# Altium project DMX Interface DB v2.PrjPcb (part 1 of 5)
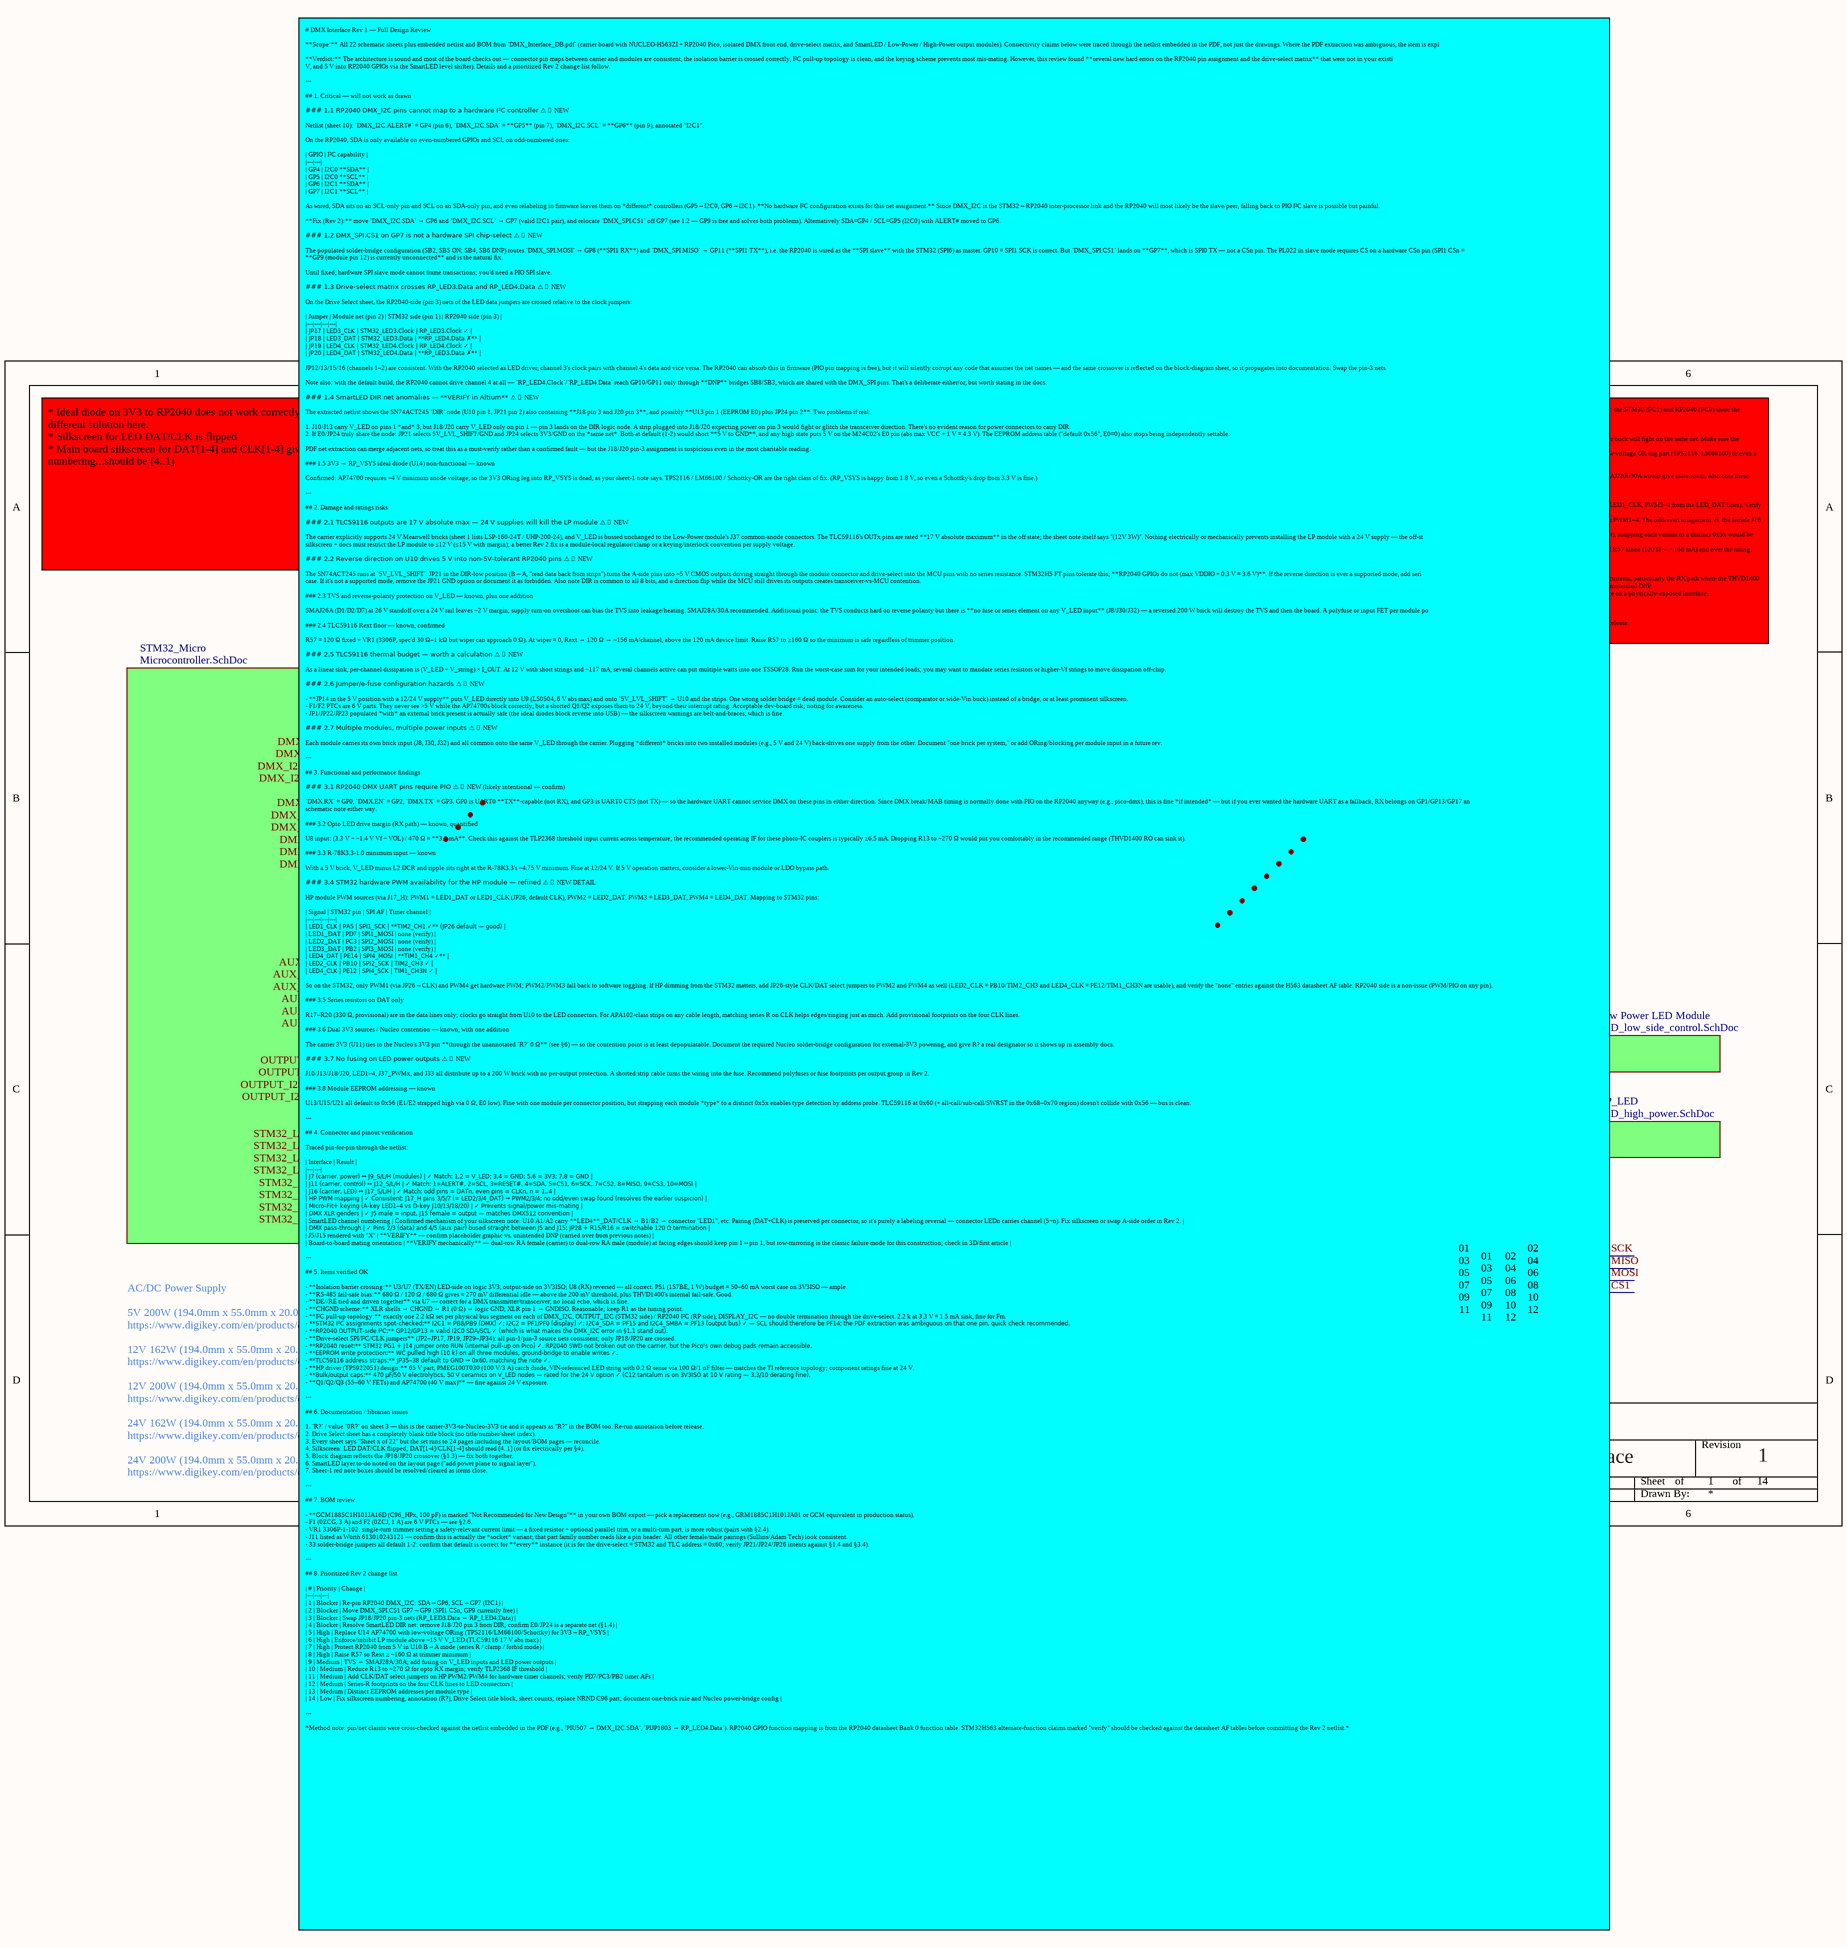
[diagram p0: Block Diagram.SchDoc]
PROJECT_TITLE: DMX Interface; REV: 1
14 sheets, 320 parts. Net scope: hierarchical (ports join the sheet entries above them; power ports are global).
Board file: DMX Interface.PcbDoc
Sheets:
  Block Diagram.SchDoc
    DMX_RP2040 = DMX_RP2040.SchDoc
      DMX = DMX.SchDoc
      PI = RP2040.SchDoc
    Low Power LED Module = LED_low_side_control.SchDoc
      PWM1 = LED_low_side_connector.SchDoc
      PWM2 = LED_low_side_connector.SchDoc
      PWM3 = LED_low_side_connector.SchDoc
      L = Module Connector Male.SchDoc
      PWM4 = LED_low_side_connector.SchDoc
    STM32_Micro = Microcontroller.SchDoc
      MI = STM32.SchDoc
    SL = SmartLED.SchDoc
      S = Module Connector Male.SchDoc
    HP_LED = LED_high_power.SchDoc
      H = Module Connector Male.SchDoc
      HP1 = TPS922051.SchDoc
      HP2 = TPS922051.SchDoc
      HP3 = TPS922051.SchDoc
      HP4 = TPS922051.SchDoc
    MC = Module Connector Female.SchDoc
    DS = Drive Select.SchDoc

## Sheet Block Diagram.SchDoc: Block Diagram
size B; SheetNumber: 1; SheetTotal: 14

### Parts
J22  Header 6x2 0.1"  [HEADER 6x2 0.1 Through hole]  (value not drawn)

### Sub-sheets
DMX_RP2040 = DMX_RP2040.SchDoc: RESET# (in), RP2040_SCL, RP2040_SDA, RP2040_I2C_RESET, RP2040_I2C_ALERT, RP_LED1.Clock, RP_LED2.Clock, RP_LED3.Clock, RP_LED4.Clock, RP_LED1.Data, RP_LED2.Data, RP_LED3.Data, RP_LED4.Data, DMX_I2C.SCL, DMX_I2C.SDA, DMX_I2C.ALERT#, DMX_I2C.RESET#, DMX_SPI.SCK, DMX_SPI.MISO, DMX_SPI.MOSI, DMX_SPI.CS1
DS = Drive Select.SchDoc: SCK, MISO, MOSI, CS1, CS2, CS3, SCL, SDA, I2C_ALERT#, I2C_RESET#, LED1_CLK (bidir), LED2_CLK (bidir), LED3_CLK (bidir), LED4_CLK (bidir), LED1_DAT (bidir), LED2_DAT (bidir), LED3_DAT (bidir), LED4_DAT (bidir), AUX_SPI.SCK, DMX_SPI.SCK, AUX_SPI.MISO, DMX_SPI.MISO, AUX_SPI.MOSI, DMX_SPI.MOSI, AUX_SPI.CS1, DMX_SPI.CS1, AUX_SPI.CS2, AUX_SPI.CS3, OUTPUT_I2C.SCL, RP2040_SCL, OUTPUT_I2C.SDA, RP2040_SDA, RP2040_I2C_RESET, STM32_LED1.Clock, RP_LED1.Clock, STM32_LED2.Clock, RP_LED2.Clock, STM32_LED3.Clock, RP_LED3.Clock, STM32_LED4.Clock, RP_LED4.Clock, STM32_LED1.Data, RP_LED1.Data, RP_LED2.Data, RP_LED4.Data, STM32_LED2.Data, STM32_LED3.Data, STM32_LED4.Data, RP_LED3.Data, OUTPUT_I2C.ALERT#, OUTPUT_I2C.RESET#, RP2040_I2C_ALERT, DMX_SPI.CS3, DMX_SPI.CS2
HP_LED = LED_high_power.SchDoc: no entries
Low Power LED Module = LED_low_side_control.SchDoc: no entries
MC = Module Connector Female.SchDoc: SCK, MISO, MOSI, CS1, CS2, CS3, SCL, SDA, I2C_ALERT#, I2C_RESET#, LED1_CLK (in), LED2_CLK (in), LED3_CLK (in), LED4_CLK (in), LED1_DAT (in), LED2_DAT (in), LED3_DAT (in), LED4_DAT (in)
SL = SmartLED.SchDoc: LED1_CLK (bidir), LED2_CLK (bidir), LED3_CLK (bidir), LED4_CLK (bidir), LED1_DAT (bidir), LED2_DAT (bidir), LED3_DAT (bidir), LED4_DAT (bidir)
STM32_Micro = Microcontroller.SchDoc: RESET# (out), DMX_I2C.SCL, DMX_I2C.SDA, DMX_I2C.ALERT#, DMX_I2C.RESET#, DMX_SPI.SCK, DMX_SPI.MISO, DMX_SPI.MOSI, DMX_SPI.CS1, DMX_SPI.CS2, DMX_SPI.CS3, AUX_SPI.SCK, AUX_SPI.MISO, AUX_SPI.MOSI, AUX_SPI.CS1, AUX_SPI.CS2, AUX_SPI.CS3, OUTPUT_I2C.SCL, OUTPUT_I2C.SDA, OUTPUT_I2C.ALERT#, OUTPUT_I2C.RESET#, STM32_LED1.Clock, STM32_LED2.Clock, STM32_LED3.Clock, STM32_LED4.Clock, STM32_LED1.Data, STM32_LED2.Data, STM32_LED3.Data, STM32_LED4.Data

### Nets
3V3: J22.09
GND: J22.11
AUX_SPI.CS1: sheet STM32_Micro/AUX_SPI.CS1, sheet DS/AUX_SPI.CS1
AUX_SPI.CS2: sheet STM32_Micro/AUX_SPI.CS2, sheet DS/AUX_SPI.CS2
AUX_SPI.CS3: sheet STM32_Micro/AUX_SPI.CS3, sheet DS/AUX_SPI.CS3
AUX_SPI.MISO: sheet STM32_Micro/AUX_SPI.MISO, sheet DS/AUX_SPI.MISO
AUX_SPI.MOSI: sheet STM32_Micro/AUX_SPI.MOSI, sheet DS/AUX_SPI.MOSI
AUX_SPI.SCK: sheet STM32_Micro/AUX_SPI.SCK, sheet DS/AUX_SPI.SCK
CS1: sheet MC/CS1, sheet DS/CS1
CS2: sheet MC/CS2, sheet DS/CS2
CS3: sheet MC/CS3, sheet DS/CS3
DMX_I2C.ALERT#: J22.05 ; sheet DMX_RP2040/DMX_I2C.ALERT#, sheet STM32_Micro/DMX_I2C.ALERT#
DMX_I2C.RESET#: J22.07 ; sheet DMX_RP2040/DMX_I2C.RESET#, sheet STM32_Micro/DMX_I2C.RESET#
DMX_I2C.SCL: J22.01 ; sheet DMX_RP2040/DMX_I2C.SCL, sheet STM32_Micro/DMX_I2C.SCL
DMX_I2C.SDA: J22.03 ; sheet DMX_RP2040/DMX_I2C.SDA, sheet STM32_Micro/DMX_I2C.SDA
DMX_SPI.CS1: J22.08 ; sheet DMX_RP2040/DMX_SPI.CS1, sheet STM32_Micro/DMX_SPI.CS1, sheet DS/DMX_SPI.CS1
DMX_SPI.CS2: sheet STM32_Micro/DMX_SPI.CS2, sheet DS/DMX_SPI.CS2
DMX_SPI.CS3: sheet STM32_Micro/DMX_SPI.CS3, sheet DS/DMX_SPI.CS3
DMX_SPI.MISO: J22.04 ; sheet DMX_RP2040/DMX_SPI.MISO, sheet STM32_Micro/DMX_SPI.MISO, sheet DS/DMX_SPI.MISO
DMX_SPI.MOSI: J22.06 ; sheet DMX_RP2040/DMX_SPI.MOSI, sheet STM32_Micro/DMX_SPI.MOSI, sheet DS/DMX_SPI.MOSI
DMX_SPI.SCK: J22.02 ; sheet DMX_RP2040/DMX_SPI.SCK, sheet STM32_Micro/DMX_SPI.SCK, sheet DS/DMX_SPI.SCK
I2C_ALERT#: sheet MC/I2C_ALERT#, sheet DS/I2C_ALERT#
I2C_RESET#: sheet MC/I2C_RESET#, sheet DS/I2C_RESET#
LED1_CLK: sheet SL/LED1_CLK, sheet MC/LED1_CLK, sheet DS/LED1_CLK
LED1_DAT: sheet SL/LED1_DAT, sheet MC/LED1_DAT, sheet DS/LED1_DAT
LED2_CLK: sheet SL/LED2_CLK, sheet MC/LED2_CLK, sheet DS/LED2_CLK
LED2_DAT: sheet SL/LED2_DAT, sheet MC/LED2_DAT, sheet DS/LED2_DAT
LED3_CLK: sheet SL/LED3_CLK, sheet MC/LED3_CLK, sheet DS/LED3_CLK
LED3_DAT: sheet SL/LED3_DAT, sheet MC/LED3_DAT, sheet DS/LED3_DAT
LED4_CLK: sheet SL/LED4_CLK, sheet MC/LED4_CLK, sheet DS/LED4_CLK
LED4_DAT: sheet SL/LED4_DAT, sheet MC/LED4_DAT, sheet DS/LED4_DAT
MISO: sheet MC/MISO, sheet DS/MISO
MOSI: sheet MC/MOSI, sheet DS/MOSI
OUTPUT_I2C.ALERT#: sheet STM32_Micro/OUTPUT_I2C.ALERT#, sheet DS/OUTPUT_I2C.ALERT#
OUTPUT_I2C.RESET#: sheet STM32_Micro/OUTPUT_I2C.RESET#, sheet DS/OUTPUT_I2C.RESET#
OUTPUT_I2C.SCL: sheet STM32_Micro/OUTPUT_I2C.SCL, sheet DS/OUTPUT_I2C.SCL
OUTPUT_I2C.SDA: sheet STM32_Micro/OUTPUT_I2C.SDA, sheet DS/OUTPUT_I2C.SDA
RP2040_I2C_ALERT: sheet DMX_RP2040/RP2040_I2C_ALERT, sheet DS/RP2040_I2C_ALERT
RP2040_I2C_RESET: sheet DMX_RP2040/RP2040_I2C_RESET, sheet DS/RP2040_I2C_RESET
RP2040_RST#: sheet DMX_RP2040/RESET#, sheet STM32_Micro/RESET#
RP2040_SCL: sheet DMX_RP2040/RP2040_SCL, sheet DS/RP2040_SCL
RP2040_SDA: sheet DMX_RP2040/RP2040_SDA, sheet DS/RP2040_SDA
RP_LED1.Clock: sheet DMX_RP2040/RP_LED1.Clock, sheet DS/RP_LED1.Clock
RP_LED1.Data: sheet DMX_RP2040/RP_LED1.Data, sheet DS/RP_LED1.Data
RP_LED2.Clock: sheet DMX_RP2040/RP_LED2.Clock, sheet DS/RP_LED2.Clock
RP_LED2.Data: sheet DMX_RP2040/RP_LED2.Data, sheet DS/RP_LED2.Data
RP_LED3.Clock: sheet DMX_RP2040/RP_LED3.Clock, sheet DS/RP_LED3.Clock
RP_LED3.Data: sheet DMX_RP2040/RP_LED3.Data, sheet DS/RP_LED3.Data
RP_LED4.Clock: sheet DMX_RP2040/RP_LED4.Clock, sheet DS/RP_LED4.Clock
RP_LED4.Data: sheet DMX_RP2040/RP_LED4.Data, sheet DS/RP_LED4.Data
SCK: sheet MC/SCK, sheet DS/SCK
SCL: sheet MC/SCL, sheet DS/SCL
SDA: sheet MC/SDA, sheet DS/SDA
STM32_LED1.Clock: sheet STM32_Micro/STM32_LED1.Clock, sheet DS/STM32_LED1.Clock
STM32_LED1.Data: sheet STM32_Micro/STM32_LED1.Data, sheet DS/STM32_LED1.Data
STM32_LED2.Clock: sheet STM32_Micro/STM32_LED2.Clock, sheet DS/STM32_LED2.Clock
STM32_LED2.Data: sheet STM32_Micro/STM32_LED2.Data, sheet DS/STM32_LED2.Data
STM32_LED3.Clock: sheet STM32_Micro/STM32_LED3.Clock, sheet DS/STM32_LED3.Clock
STM32_LED3.Data: sheet STM32_Micro/STM32_LED3.Data, sheet DS/STM32_LED3.Data
STM32_LED4.Clock: sheet STM32_Micro/STM32_LED4.Clock, sheet DS/STM32_LED4.Clock
STM32_LED4.Data: sheet STM32_Micro/STM32_LED4.Data, sheet DS/STM32_LED4.Data

Not connected (* = marked no-connect by the designer): J22 10* 12*

### Notes on the sheet
- * Ideal diode on 3V3 to RP2040 does not work correctly when supply is less than 4V. Need a different solution here.
  * Silkscreen for LED DAT/CLK is flipped
  * Main board silkscreen for DAT[1-4] and CLK[1-4] give the wrong indication of the numbering...should be [4..1]
- This is a nicely architected board — the flexible "drive select" jumper matrix, the isolated DMX front end, per-module ID EEPROMs, and the interchangeable module-connector concept are all sensible. The core premise checks out: the STM32 (I²C1) and RP2040 (I²C0) share the `DMX_I2C` bus as the inter-processor link, and it's pulled up once (R26–R29, 2.2k to 3V3 on the STM32 side), so no double-termination. Below are the things worth a second look, roughly in priority order.
  **Power architecture (highest-value items)**
  - **Dual 3V3 sources / Nucleo contention.** The carrier generates 3V3 from U11 (R-78K3.3) and ties it to the Nucleo's CN8/CN11 3V3 pins. If the Nucleo is ever powered from its own ST-LINK USB, its onboard 3V3 LDO and your buck will fight on the same net. Make sure the Nucleo's power-source solder bridges are configured for external 3V3 (and document it), or isolate the two. Same logic applies to the 5V rail, though the jumper notes already address that path.
  - **AP74700 on the 3V3→RP_VSYS OR-ing (U14).** You've already flagged this on sheet 1 — the ideal-diode controller won't operate below ~4V, so the 3V3 leg is effectively dead. Since RP_VSYS is happy from ~1.8V up, a low-voltage OR-ing part (TPS2116, LM66100) or even a Schottky-OR would fix it cleanly.
  - **R-78K3.3 minimum input.** In the 5V-supply configuration V_LED ≈ 5V feeds U11. Confirm the R-78K3.3-1.0 min Vin (I believe ~4.75V) against 5V with ripple/droop — it's near the bottom of the window.
  - **TVS standoff margin.** D1/D2/D7 are SMAJ26A on a rail that can be 24V. 26V standoff over a 24V nominal is only ~2V of headroom, so turn-on overshoot from the Meanwell bricks could nibble the TVS leakage/heating. SMAJ28A/30A would give more room. Also note these clamp reverse polarity but don't truly protect it (no series element/fuse on V_LED), which is fine for a dev board but worth a conscious decision.
  **Functional / signal concerns**
  - **LED CLK/DAT pins doing double duty.** On SmartLED modules these lines are SPI (SPI1/2/3/4 SCK+MOSI on the STM32). On the HP module the same physical lines are repurposed as PWM dimming (PWM1 via JP26 from LED1_CLK, PWM2–4 from the LED_DAT lines). Verify that the specific STM32H563 pins mapped to those SPI functions *also* expose a timer channel for hardware PWM — otherwise HP dimming falls back to bit-banging. On the RP2040 side PIO makes this a non-issue.
  - **HP module PWM pin mapping.** Cross-check the `_H` male-connector definition (sheet 7: PWM2/3/4 on J17_H odd pins, LED nets on even) against how the HP module (sheet 17) actually consumes LED1_CLK/LED_DAT as PWM1–4. The odd/even assignment vs. the female J16 (pin1=LED1_DAT, pin2=LED1_CLK, …) is where I'd expect a swap to hide if there is one.
  - **Module EEPROM addresses.** U13 / U15 / U21 all default to 0x56. That's fine electrically since one module mounts per connector, but if you want host-side module-type detection by address probe (rather than reading content), strapping each variant to a distinct 0x5x would be handy. TLC59116 at 0x60 plus its default all-call/sub-call/SWReset addresses don't collide with 0x56, so that bus is clean.
  - **TLC59116 Rext / current limit.** Your own annotation lands at ~117 mA (Rext 150), just under the 120 mA/channel device max. But that assumes VR1's 30 Ω floor; a 3306P wiper can approach 0 Ω, which pushes Rext toward R57 alone (120 Ω → ~156 mA) and over the rating. Consider raising the fixed series resistor so the *minimum* Rext can't exceed the current limit regardless of trimmer position.
  **DMX / isolation**
  - The isolation looks well thought out — 1S7BE isolated DC-DC, TLP2368 optos on RX/EN/TX (fast enough for 250 kbps), fail-safe bias (R10/R11), switchable 120 Ω term via JP28. Two things to confirm: (1) the opto LED drive currents, particularly the RX path where the THVD1400 RO drives through R13 (470 Ω) — verify you're comfortably above the TLP2368 threshold with margin; and (2) both DMX connectors (J5/J15) render with an "X" over them — confirm that's just a placeholder graphic and not an unintended DNP.
  - For anything beyond bench use, consider a dedicated TVS across the DMX A/B lines. The THVD1400 has decent built-in IEC ESD/bus-fault ratings, so it may be sufficient for a dev board, but external protection is cheap insurance on a physically-exposed interface.
  **Completeness / documentation**
  - Sheet 3 has an unannotated part — `R?` with value `0R?` near the AUX/GPIO area. That needs a real designator and value (looks like annotation wasn't re-run, or it's a leftover placeholder).
  - The Drive Select sheet (22) has an entirely blank title block (no title, number, or sheet index). All sheets also show "Sheet 1 of 22" while the actual set runs to 24 pages including the board-stack report — worth reconciling before release.
  - Your existing silkscreen notes (LED DAT/CLK flipped; DAT[1-4]/CLK[1-4] should read [4..1]; SmartLED power-plane layer to-do) are all legitimate — no disagreement there.
- AC/DC Power Supply
  5V 200W (194.0mm x 55.0mm x 20.0mm)
  https://www.digikey.com/en/products/detail/mean-well-usa-inc/UHP-200A-5/7707187
  12V 162W (194.0mm x 55.0mm x 20.0mm)
  https://www.digikey.com/en/products/detail/mean-well-usa-inc/LSP-160-12T/11689253
  12V 200W (194.0mm x 55.0mm x 20.0mm)
  https://www.digikey.com/en/products/detail/mean-well-usa-inc/UHP-200-12/7707237
  24V 162W (194.0mm x 55.0mm x 20.0mm)
  https://www.digikey.com/en/products/detail/mean-well-usa-inc/LSP-160-24T/11689249
  24V 200W (194.0mm x 55.0mm x 20.0mm)
  https://www.digikey.com/en/products/detail/mean-well-usa-inc/UHP-200-24/7707239
- of
- (near J22) # DMX Interface Rev 1 — Full Design Review
  **Scope:** All 22 schematic sheets plus embedded netlist and BOM from `DMX_Interface_DB.pdf` (carrier board with NUCLEO-H563ZI + RP2040 Pico, isolated DMX front end, drive-select matrix, and SmartLED / Low-Power / High-Power output modules). Connectivity claims below were traced through the netlist embedded in the PDF, not just the drawings. Where the PDF extraction was ambiguous, the item is explicitly marked **VERIFY**.
  **Verdict:** The architecture is sound and most of the board checks out — connector pin maps between carrier and modules are consistent, the isolation barrier is crossed correctly, I²C pull-up topology is clean, and the keying scheme prevents most mis-mating. However, this review found **several new hard errors on the RP2040 pin assignment and the drive-select matrix** that were not in your existing notes, plus two **absolute-maximum-rating hazards** (TLC59116 at 24 V, and 5 V into RP2040 GPIOs via the SmartLED level shifter). Details and a prioritized Rev 2 change list follow.
  ---
  ## 1. Critical — will not work as drawn
  ### 1.1 RP2040 DMX_I2C pins cannot map to a hardware I²C controller ⚠️ NEW
  Netlist (sheet 10): `DMX_I2C.ALERT#` = GP4 (pin 6), `DMX_I2C.SDA` = **GP5** (pin 7), `DMX_I2C.SCL` = **GP6** (pin 9), annotated "I2C1".
  On the RP2040, SDA is only available on even-numbered GPIOs and SCL on odd-numbered ones:
  | GPIO | I²C capability |
  |---|---|
  | GP4 | I2C0 **SDA** |
  | GP5 | I2C0 **SCL** |
  | GP6 | I2C1 **SDA** |
  | GP7 | I2C1 **SCL** |
  As wired, SDA sits on an SCL-only pin and SCL on an SDA-only pin, and even relabeling in firmware leaves them on *different* controllers (GP5→I2C0, GP6→I2C1). **No hardware I²C configuration exists for this net assignment.** Since DMX_I2C is the STM32↔RP2040 inter-processor link and the RP2040 will most likely be the slave/peer, falling back to PIO I²C slave is possible but painful.
  **Fix (Rev 2):** move `DMX_I2C.SDA` → GP6 and `DMX_I2C.SCL` → GP7 (valid I2C1 pair), and relocate `DMX_SPI.CS1` off GP7 (see 1.2 — GP9 is free and solves both problems). Alternatively SDA=GP4 / SCL=GP5 (I2C0) with ALERT# moved to GP6.
  ### 1.2 DMX_SPI.CS1 on GP7 is not a hardware SPI chip-select ⚠️ NEW
  The populated solder-bridge configuration (SB2, SB5 ON; SB4, SB6 DNP) routes `DMX_SPI.MOSI` → GP8 (**SPI1 RX**) and `DMX_SPI.MISO` → GP11 (**SPI1 TX**), i.e. the RP2040 is wired as the **SPI slave** with the STM32 (SPI6) as master. GP10 = SPI1 SCK is correct. But `DMX_SPI.CS1` lands on **GP7**, which is SPI0 TX — not a CSn pin. The PL022 in slave mode requires CS on a hardware CSn pin (SPI1 CSn = GP9 or GP13). GP13 is taken by `RP2040_SCL`; **GP9 (module pin 12) is currently unconnected** and is the natural fix.
  Until fixed, hardware SPI slave mode cannot frame transactions; you'd need a PIO SPI slave.
  ### 1.3 Drive-select matrix crosses RP_LED3.Data and RP_LED4.Data ⚠️ NEW
  On the Drive Select sheet, the RP2040-side (pin 3) nets of the LED data jumpers are crossed relative to the clock jumpers:
  | Jumper | Module net (pin 2) | STM32 side (pin 1) | RP2040 side (pin 3) |
  |---|---|---|---|
  | JP17 | LED3_CLK | STM32_LED3.Clock | RP_LED3.Clock ✓ |
  | JP18 | LED3_DAT | STM32_LED3.Data | **RP_LED4.Data ✗** |
  | JP19 | LED4_CLK | STM32_LED4.Clock | RP_LED4.Clock ✓ |
  | JP20 | LED4_DAT | STM32_LED4.Data | **RP_LED3.Data ✗** |
  JP12/13/15/16 (channels 1–2) are consistent. With the RP2040 selected as LED driver, channel 3's clock pairs with channel 4's data and vice versa. The RP2040 can absorb this in firmware (PIO pin mapping is free), but it will silently corrupt any code that assumes the net names — and the same crossover is reflected on the block-diagram sheet, so it propagates into documentation. Swap the pin-3 nets of JP18/JP20.
  Note also: with the default build, the RP2040 cannot drive channel 4 at all — `RP_LED4.Clock`/`RP_LED4.Data` reach GP10/GP11 only through **DNP** bridges SB8/SB3, which are shared with the DMX_SPI pins. That's a deliberate either/or, but worth stating in the docs.
  ### 1.4 SmartLED DIR net anomalies — **VERIFY in Altium** ⚠️ NEW
  The extracted netlist shows the SN74ACT245 `DIR` node (U10 pin 1, JP21 pin 2) also containing **J18 pin 3 and J20 pin 3**, and possibly **U13 pin 1 (EEPROM E0) plus JP24 pin 2**. Two problems if real:
  1. J10/J13 carry V_LED on pins 1 *and* 3, but J18/J20 carry V_LED only on pin 1 — pin 3 lands on the DIR logic node. A strip plugged into J18/J20 expecting power on pin 3 would fight or glitch the transceiver direction. There's no evident reason for power connectors to carry DIR.
  2. If E0/JP24 truly share the node: JP21 selects 5V_LVL_SHIFT/GND and JP24 selects 3V3/GND on the *same net*. Both at default (1-2) would short **5 V to GND**, and any high state puts 5 V on the M24C02's E0 pin (abs max VCC + 1 V = 4.3 V). The EEPROM address table ("default 0x56", E0=0) also stops being independently settable.
  PDF net extraction can merge adjacent nets, so treat this as a must-verify rather than a confirmed fault — but the J18/J20 pin-3 assignment is suspicious even in the most charitable reading.
  ### 1.5 3V3 → RP_VSYS ideal diode (U14) non-functional — known
  Confirmed: AP74700 requires ~4 V minimum anode voltage, so the 3V3 ORing leg into RP_VSYS is dead, as your sheet-1 note says. TPS2116 / LM66100 / Schottky-OR are the right class of fix. (RP_VSYS is happy from 1.8 V, so even a Schottky's drop from 3.3 V is fine.)
  ---
  ## 2. Damage and ratings risks
  ### 2.1 TLC59116 outputs are 17 V absolute max — 24 V supplies will kill the LP module ⚠️ NEW
  The carrier explicitly supports 24 V Meanwell bricks (sheet 1 lists LSP-160-24T / UHP-200-24), and V_LED is bussed unchanged to the Low-Power module's J37 common-anode connectors. The TLC59116's OUTx pins are rated **17 V absolute maximum** in the off state; the sheet note itself says "(12V 3W)". Nothing electrically or mechanically prevents installing the LP module with a 24 V supply — the off-state sink pins will see 24 V and exceed abs max. At minimum, silkscreen + docs must restrict the LP module to ≤12 V (≤15 V with margin); a better Rev 2 fix is a module-local regulator/clamp or a keying/interlock convention per supply voltage.
  ### 2.2 Reverse direction on U10 drives 5 V into non-5V-tolerant RP2040 pins ⚠️ NEW
  The SN74ACT245 runs at `5V_LVL_SHIFT`. JP21 in the DIR-low position (B→A, "read data back from strips") turns the A-side pins into ~5 V CMOS outputs driving straight through the module connector and drive-select into the MCU pins with no series resistance. STM32H5 FT pins tolerate this; **RP2040 GPIOs do not (max VDDIO + 0.3 V ≈ 3.6 V)**. If the reverse direction is ever a supported mode, add series resistors and/or clamp, or drop U10's VCC to 3.3 V for that use case. If it's not a supported mode, remove the JP21 GND option or document it as forbidden. Also note DIR is common to all 8 bits, and a direction flip while the MCU still drives its outputs creates transceiver-vs-MCU contention.
  ### 2.3 TVS and reverse-polarity protection on V_LED — known, plus one addition
  SMAJ26A (D1/D2/D7) at 26 V standoff over a 24 V rail leaves ~2 V margin; supply turn-on overshoot can bias the TVS into leakage/heating. SMAJ28A/30A recommended. Additional point: the TVS conducts hard on reverse polarity but there is **no fuse or series element on any V_LED input** (J8/J30/J32) — a reversed 200 W brick will destroy the TVS and then the board. A polyfuse or input FET per module power connector is cheap insurance even on a dev board.
  ### 2.4 TLC59116 Rext floor — known, confirmed
  R57 = 120 Ω fixed + VR1 (3306P, spec'd 30 Ω–1 kΩ but wiper can approach 0 Ω). At wiper ≈ 0, Rext → 120 Ω → ~156 mA/channel, above the 120 mA device limit. Raise R57 to ≥160 Ω so the minimum is safe regardless of trimmer position.
  ### 2.5 TLC59116 thermal budget — worth a calculation ⚠️ NEW
  As a linear sink, per-channel dissipation is (V_LED − V_string) × I_OUT. At 12 V with short strings and ~117 mA, several channels active can put multiple watts into one TSSOP28. Run the worst-case sum for your intended loads; you may want to mandate series resistors or higher-Vf strings to move dissipation off-chip.
  ### 2.6 Jumper/e-fuse configuration hazards ⚠️ NEW
  - **JP14 in the 5 V position with a 12/24 V supply** puts V_LED directly into U9 (LS0504, 6 V abs max) and onto `5V_LVL_SHIFT` → U10 and the strips. One wrong solder bridge = dead module. Consider an auto-select (comparator or wide-Vin buck) instead of a bridge, or at least prominent silkscreen.
  - F1/F2 PTCs are 6 V parts. They never see >5 V while the AP74700s block correctly, but a shorted Q1/Q2 exposes them to 24 V, beyond their interrupt rating. Acceptable dev-board risk; noting for awareness.
  - JP1/JP22/JP23 populated *with* an external brick present is actually safe (the ideal diodes block reverse into USB) — the silkscreen warnings are belt-and-braces, which is fine.
  ### 2.7 Multiple modules, multiple power inputs ⚠️ NEW
  Each module carries its own brick input (J8, J30, J32) and all common onto the same V_LED through the carrier. Plugging *different* bricks into two installed modules (e.g., 5 V and 24 V) back-drives one supply from the other. Document "one brick per system," or add ORing/blocking per module input in a future rev.
  ---
  ## 3. Functional and performance findings
  ### 3.1 RP2040 DMX UART pins require PIO ⚠️ NEW (likely intentional — confirm)
  `DMX.RX` = GP0, `DMX.EN` = GP2, `DMX.TX` = GP3. GP0 is UART0 **TX**-capable (not RX), and GP3 is UART0 CTS (not TX) — so the hardware UART cannot service DMX on these pins in either direction. Since DMX break/MAB timing is normally done with PIO on the RP2040 anyway (e.g., pico-dmx), this is fine *if intended* — but if you ever wanted the hardware UART as a fallback, RX belongs on GP1/GP13/GP17 and TX on GP0/GP4/GP8/GP12/GP16. Worth a schematic note either way.
  ### 3.2 Opto LED drive margin (RX path) — known, quantified
  U8 input: (3.3 V − ~1.4 V Vf − VOL) / 470 Ω ≈ **3.8 mA**. Check this against the TLP2368 threshold input current across temperature; the recommended operating IF for these photo-IC couplers is typically ≥6.5 mA. Dropping R13 to ~270 Ω would put you comfortably in the recommended range (THVD1400 RO can sink it).
  ### 3.3 R-78K3.3-1.0 minimum input — known
  With a 5 V brick, V_LED minus L2 DCR and ripple sits right at the R-78K3.3's ~4.75 V minimum. Fine at 12/24 V. If 5 V operation matters, consider a lower-Vin-min module or LDO bypass path.
  ### 3.4 STM32 hardware PWM availability for the HP module — refined ⚠️ NEW DETAIL
  HP module PWM sources (via J17_H): PWM1 = LED1_DAT or LED1_CLK (JP26, default CLK), PWM2 = LED2_DAT, PWM3 = LED3_DAT, PWM4 = LED4_DAT. Mapping to STM32 pins:
  | Signal | STM32 pin | SPI AF | Timer channel |
  |---|---|---|---|
  | LED1_CLK | PA5 | SPI1_SCK | **TIM2_CH1 ✓** (JP26 default — good) |
  | LED1_DAT | PD7 | SPI1_MOSI | none (verify) |
  | LED2_DAT | PC3 | SPI2_MOSI | none (verify) |
  | LED3_DAT | PB2 | SPI3_MOSI | none (verify) |
  | LED4_DAT | PE14 | SPI4_MOSI | **TIM1_CH4 ✓** |
  | LED2_CLK | PB10 | SPI2_SCK | TIM2_CH3 ✓ |
  | LED4_CLK | PE12 | SPI4_SCK | TIM1_CH3N ✓ |
  So on the STM32, only PWM1 (via JP26→CLK) and PWM4 get hardware PWM; PWM2/PWM3 fall back to software toggling. If HP dimming from the STM32 matters, add JP26-style CLK/DAT select jumpers to PWM2 and PWM4 as well (LED2_CLK = PB10/TIM2_CH3 and LED4_CLK = PE12/TIM1_CH3N are usable), and verify the "none" entries against the H563 datasheet AF table. RP2040 side is a non-issue (PWM/PIO on any pin).
  ### 3.5 Series resistors on DAT only
  R17–R20 (330 Ω, provisional) are in the data lines only; clocks go straight from U10 to the LED connectors. For APA102-class strips on any cable length, matching series R on CLK helps edges/ringing just as much. Add provisional footprints on the four CLK lines.
  ### 3.6 Dual 3V3 sources / Nucleo contention — known, with one addition
  The carrier 3V3 (U11) ties to the Nucleo's 3V3 pin **through the unannotated `R?` 0 Ω** (see §6) — so the contention point is at least depopulatable. Document the required Nucleo solder-bridge configuration for external-3V3 powering, and give R? a real designator so it shows up in assembly docs.
  ### 3.7 No fusing on LED power outputs ⚠️ NEW
  J10/J13/J18/J20, LED1–4, J37_PWMx, and J33 all distribute up to a 200 W brick with no per-output protection. A shorted strip cable turns the wiring into the fuse. Recommend polyfuses or fuse footprints per output group in Rev 2.
  ### 3.8 Module EEPROM addressing — known
  U13/U15/U21 all default to 0x56 (E1/E2 strapped high via 0 Ω, E0 low). Fine with one module per connector position, but strapping each module *type* to a distinct 0x5x enables type detection by address probe. TLC59116 at 0x60 (+ all-call/sub-call/SWRST in the 0x68–0x70 region) doesn't collide with 0x56 — bus is clean.
  ---
  ## 4. Connector and pinout verification
  Traced pin-for-pin through the netlist:
  | Interface | Result |
  |---|---|
  | J7 (carrier, power) ↔ J9_S/L/H (modules) | ✓ Match: 1,2 = V_LED; 3,4 = GND; 5,6 = 3V3; 7,8 = GND |
  | J11 (carrier, control) ↔ J12_S/L/H | ✓ Match: 1=ALERT#, 2=SCL, 3=RESET#, 4=SDA, 5=CS1, 6=SCK, 7=CS2, 8=MISO, 9=CS3, 10=MOSI |
  | J16 (carrier, LED) ↔ J17_S/L/H | ✓ Match: odd pins = DATn, even pins = CLKn, n = 1..4 |
  | HP PWM mapping | ✓ Consistent: J17_H pins 3/5/7 (= LED2/3/4_DAT) → PWM2/3/4; no odd/even swap found (resolves the earlier suspicion) |
  | Micro-Fit+ keying (A-key LED1–4 vs D-key J10/13/18/20) | ✓ Prevents signal/power mis-mating |
  | DMX XLR genders | ✓ J5 male = input, J15 female = output — matches DMX512 convention |
  | SmartLED channel numbering | Confirmed mechanism of your silkscreen note: U10 A1/A2 carry **LED4**_DAT/CLK → B1/B2 → connector "LED1", etc. Pairing (DAT+CLK) is preserved per connector, so it's purely a labeling reversal — connector LEDn carries channel (5−n). Fix silkscreen or swap A-side order in Rev 2. |
  | DMX pass-through | ✓ Pins 2/3 (data) and 4/5 (aux pair) bused straight between J5 and J15; JP28 + R15/R16 = switchable 120 Ω termination |
  | J5/J15 rendered with "X" | **VERIFY** — confirm placeholder graphic vs. unintended DNP (carried over from previous notes) |
  | Board-to-board mating orientation | **VERIFY mechanically** — dual-row RA female (carrier) to dual-row RA male (module) at facing edges should keep pin 1↔pin 1, but row-mirroring is the classic failure mode for this construction; check in 3D/first article |
  ---
  ## 5. Items verified OK
  - **Isolation barrier crossing:** U3/U7 (TX/EN) LED-side on logic 3V3, output-side on 3V3ISO; U8 (RX) reversed — all correct. PS1 (1S7BE, 1 W) budget ≈ 50–60 mA worst case on 3V3ISO — ample.
  - **RS-485 fail-safe bias:** 680 Ω / 120 Ω / 680 Ω gives ≈ 270 mV differential idle — above the 200 mV threshold, plus THVD1400's internal fail-safe. Good.
  - **DE//RE tied and driven together** via U7 — correct for a DMX transmitter/transceiver; no local echo, which is fine.
  - **CHGND scheme:** XLR shells → CHGND → R1 (0 Ω) → logic GND; XLR pin 1 → GNDISO. Reasonable; keep R1 as the tuning point.
  - **I²C pull-up topology:** exactly one 2.2 kΩ set per physical bus segment on each of DMX_I2C, OUTPUT_I2C (STM32 side) / RP2040 I²C (RP side), DISPLAY_I2C — no double termination through the drive-select. 2.2 k at 3.3 V = 1.5 mA sink, fine for Fm.
  - **STM32 I²C assignments spot-checked:** I2C1 = PB8/PB9 (DMX) ✓; I2C2 = PF1/PF0 (display) ✓; I2C4_SDA = PF15 and I2C4_SMBA = PF13 (output bus) ✓ — SCL should therefore be PF14; the PDF extraction was ambiguous on that one pin, quick check recommended.
  - **RP2040 OUTPUT-side I²C:** GP12/GP13 = valid I2C0 SDA/SCL ✓ (which is what makes the DMX_I2C error in §1.1 stand out).
  - **Drive-select SPI/I²C/CLK jumpers** (JP2–JP17, JP19, JP29–JP34): all pin-1/pin-3 source nets consistent; only JP18/JP20 are crossed.
  - **RP2040 reset:** STM32 PG1 + J14 jumper onto RUN (internal pull-up on Pico) ✓. RP2040 SWD not broken out on the carrier, but the Pico's own debug pads remain accessible.
  - **EEPROM write protection:** WC pulled high (10 k) on all three modules, ground-bridge to enable writes ✓.
  - **TLC59116 address straps:** JP35–38 default to GND → 0x60, matching the note ✓.
  - **HP driver (TPS922051) design:** 65 V part, PMEG100T030 (100 V/3 A) catch diode, VIN-referenced LED string with 0.2 Ω sense via 100 Ω/1 nF filter — matches the TI reference topology; component ratings fine at 24 V.
  - **Bulk/output caps:** 470 µF/50 V electrolytics, 50 V ceramics on V_LED nodes — rated for the 24 V option ✓ (C12 tantalum is on 3V3ISO at 10 V rating — 3.3/10 derating fine).
  - **Q1/Q2/Q3 (55–60 V FETs) and AP74700 (40 V max)** — fine against 24 V exposure.
  ---
  ## 6. Documentation / librarian issues
  1. `R?` / value `0R?` on sheet 3 — this is the carrier-3V3-to-Nucleo-3V3 tie and it appears as "R?" in the BOM too. Re-run annotation before release.
  2. Drive Select sheet has a completely blank title block (no title/number/sheet index).
  3. Every sheet says "Sheet x of 22" but the set runs to 24 pages including the layout/BOM pages — reconcile.
  4. Silkscreen: LED DAT/CLK flipped; DAT[1-4]/CLK[1-4] should read [4..1] (or fix electrically per §4).
  5. Block diagram reflects the JP18/JP20 crossover (§1.3) — fix both together.
  6. SmartLED layer to-do noted on the layout page ("add power plane to signal layer").
  7. Sheet-1 red note boxes should be resolved/cleared as items close.
  ---
  ## 7. BOM review
  - **GCM1885C1H101JA16D (C96_HPx, 100 pF) is marked "Not Recommended for New Design"** in your own BOM export — pick a replacement now (e.g., GRM1885C1H101JA01 or GCM equivalent in production status).
  - F1 (0ZCG, 3 A) and F2 (0ZCJ, 1 A) are 6 V PTCs — see §2.6.
  - VR1 3306P-1-102: single-turn trimmer setting a safety-relevant current limit — a fixed resistor + optional parallel trim, or a multi-turn part, is more robust (pairs with §2.4).
  - J11 listed as Würth 613010243121 — confirm this is actually the *socket* variant; that part family number reads like a pin header. All other female/male pairings (Sullins/Adam Tech) look consistent.
  - 33 solder-bridge jumpers all default 1-2: confirm that default is correct for **every** instance (it is for the drive-select = STM32 and TLC address = 0x60; verify JP21/JP24/JP26 intents against §1.4 and §3.4).
  ---
  ## 8. Prioritized Rev 2 change list
  | # | Priority | Change |
  |---|---|---|
  | 1 | Blocker | Re-pin RP2040 DMX_I2C: SDA→GP6, SCL→GP7 (I2C1) |
  | 2 | Blocker | Move DMX_SPI.CS1 GP7→GP9 (SPI1 CSn; GP9 currently free) |
  | 3 | Blocker | Swap JP18/JP20 pin-3 nets (RP_LED3.Data ↔ RP_LED4.Data) |
  | 4 | Blocker | Resolve SmartLED DIR net: remove J18/J20 pin 3 from DIR; confirm E0/JP24 is a separate net (§1.4) |
  | 5 | High | Replace U14 AP74700 with low-voltage ORing (TPS2116/LM66100/Schottky) for 3V3→RP_VSYS |
  | 6 | High | Enforce/inhibit LP module above ~15 V V_LED (TLC59116 17 V abs max) |
  | 7 | High | Protect RP2040 from 5 V in U10 B→A mode (series R / clamp / forbid mode) |
  | 8 | High | Raise R57 so Rext ≥ ~160 Ω at trimmer minimum |
  | 9 | Medium | TVS → SMAJ28A/30A; add fusing on V_LED inputs and LED power outputs |
  | 10 | Medium | Reduce R13 to ~270 Ω for opto RX margin; verify TLP2368 IF threshold |
  | 11 | Medium | Add CLK/DAT select jumpers on HP PWM2/PWM4 for hardware timer channels; verify PD7/PC3/PB2 timer AFs |
  | 12 | Medium | Series-R footprints on the four CLK lines to LED connectors |
  | 13 | Medium | Distinct EEPROM addresses per module type |
  | 14 | Low | Fix silkscreen numbering, annotation (R?), Drive Select title block, sheet counts; replace NRND C96 part; document one-brick rule and Nucleo power-bridge config |
  ---
  *Method note: pin/net claims were cross-checked against the netlist embedded in the PDF (e.g., `PIU507 → DMX_I2C.SDA`, `PIJP1803 → RP_LED4.Data`). RP2040 GPIO function mapping is from the RP2040 datasheet Bank 0 function table. STM32H563 alternate-function claims marked "verify" should be checked against the datasheet AF tables before committing the Rev 2 netlist.*

### Library data of the parts
J22 = CMP-002-00221-2: Board Connector Tall, 12 Contact(s), 2 Row(s), Male, Straight, 0.1 inch Pitch; Max Current Rating: 3A; Connector Type: Header; Gender: Male; Pins: 12; Mounting Technology: Board; RoHS Compliant: Yes

## Sheet DMX_RP2040.SchDoc: DMX / RP2040
size B; SheetNumber: 8; SheetTotal: 14
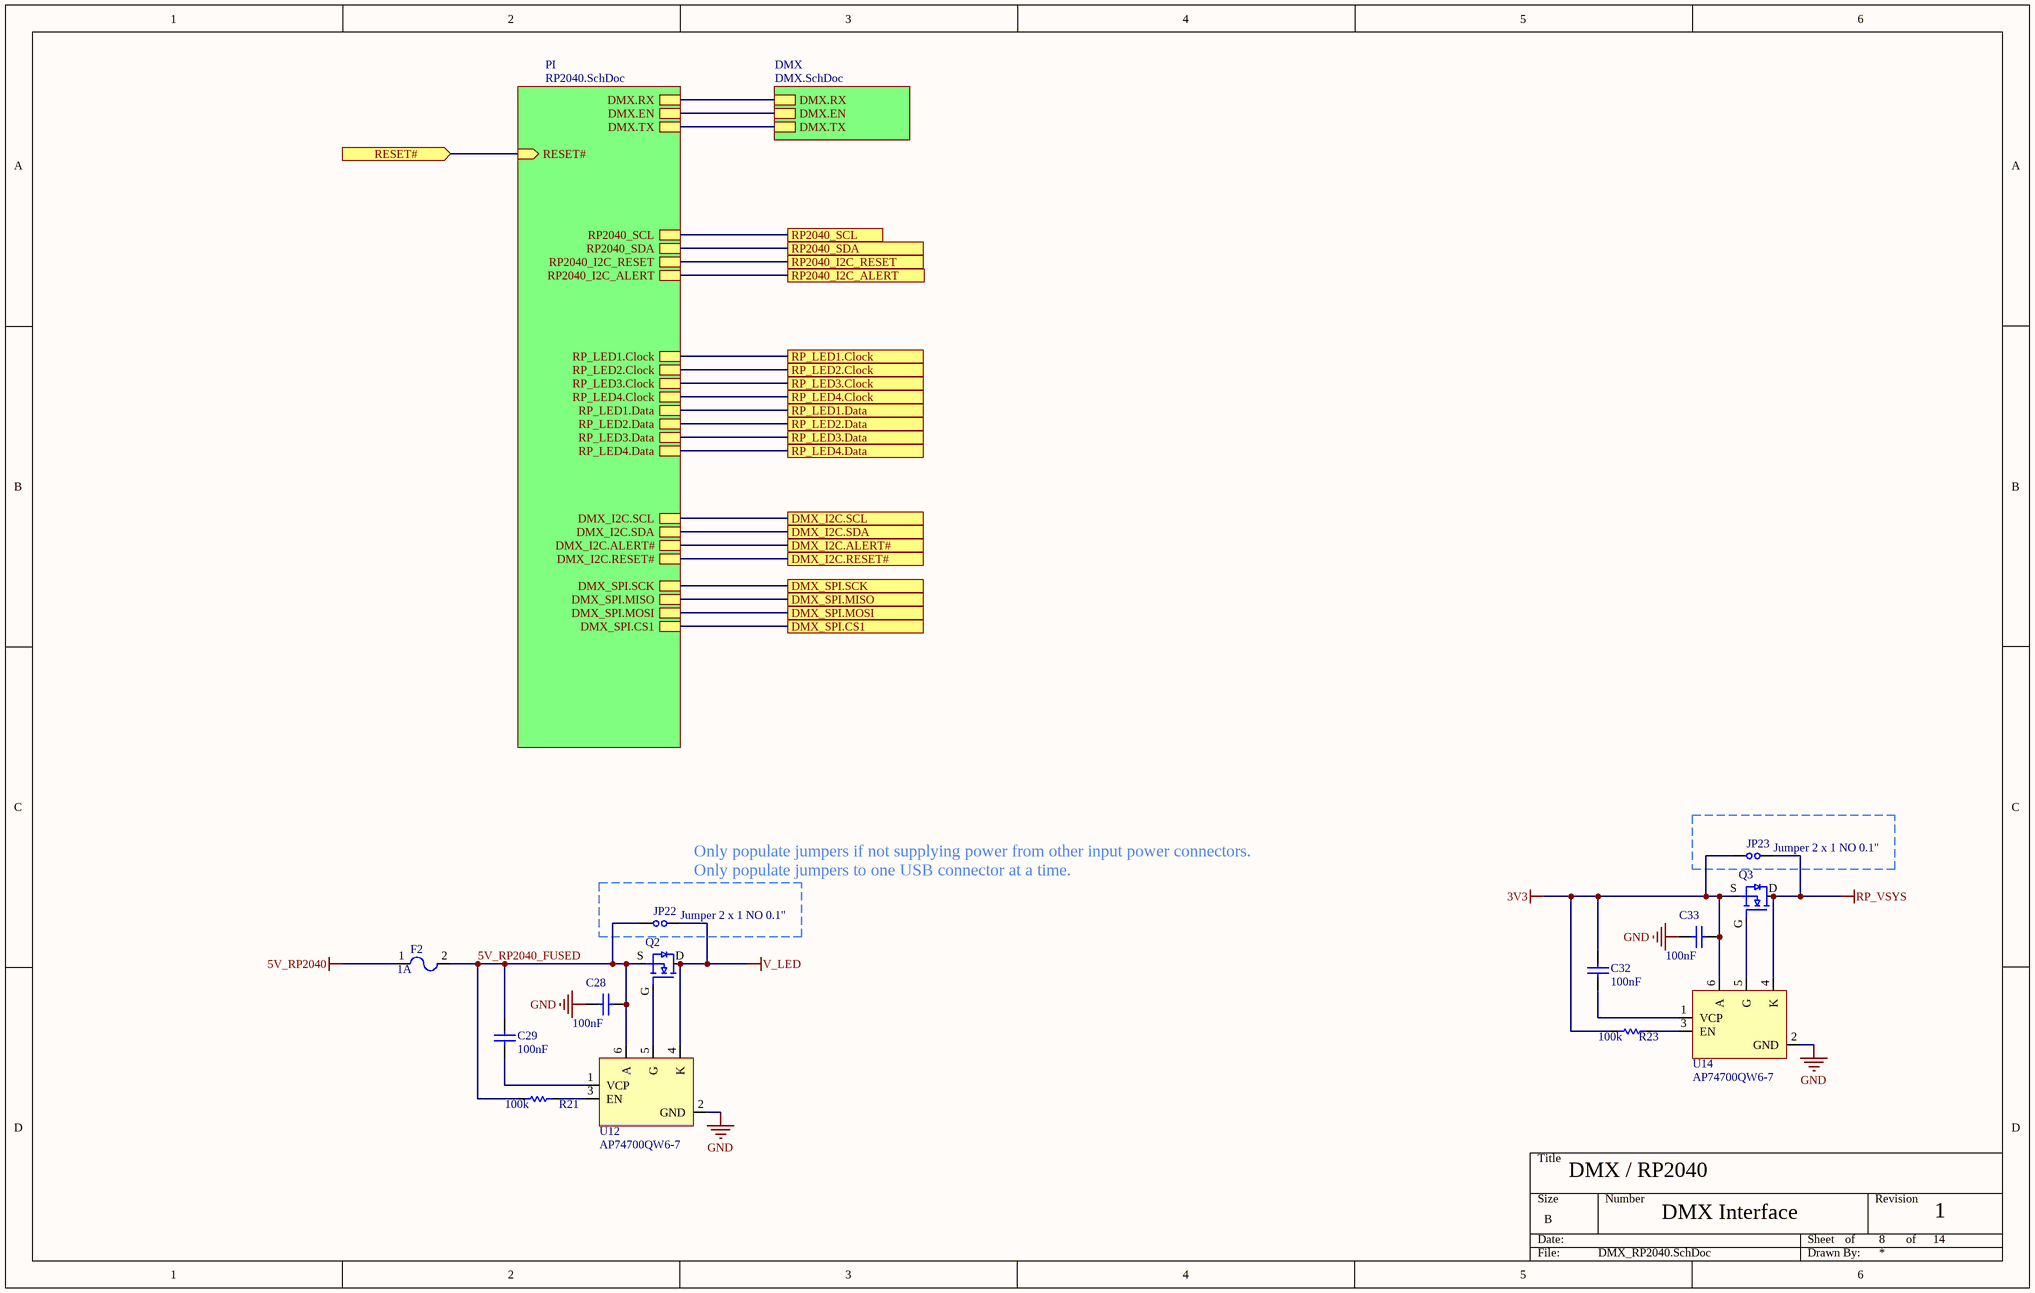
[diagram p1: DMX_RP2040.SchDoc]

### Parts
C28  value 100nF  [CAPC1608X10N_0603_MED]  (hidden comment: CC0603KRX7R0BB104)
C29  value 100nF  [CAPC1608X10N_0603_MED]  (hidden comment: CC0603KRX7R0BB104)
C32  value 100nF  [CAPC1608X10N_0603_MED]  (hidden comment: CC0603KRX7R0BB104)
C33  value 100nF  [CAPC1608X10N_0603_MED]  (hidden comment: CC0603KRX7R0BB104)
F2  Current Rating: 1A  [FUSE3216X04N_1206MED]  (hidden comment: 0ZCJ0100FF2E)
JP22  Jumper 2 x 1 NO 0.1"  [FP-M20-9990245-MFG]
JP23  Jumper 2 x 1 NO 0.1"  [FP-M20-9990245-MFG]
Q2  DMN6075S-7  [FP-SOT23-MFG]  (value not drawn)
Q3  DMN6075S-7  [FP-SOT23-MFG]  (value not drawn)
R21  value 100k  [RESC1608X06N_0603_MED]  (hidden comment: RC0603DR-07100KL)
R23  value 100k  [RESC1608X06N_0603_MED]  (hidden comment: RC0603DR-07100KL)
U12  AP74700QW6-7  [SOT95P285X130-6N]
U14  AP74700QW6-7  [SOT95P285X130-6N]

### Sub-sheets
DMX = DMX.SchDoc: DMX.RX, DMX.EN, DMX.TX
PI = RP2040.SchDoc: RESET# (in), RP2040_SCL, RP2040_SDA, RP2040_I2C_RESET, RP_LED1.Clock, RP_LED2.Clock, RP_LED3.Clock, RP_LED4.Clock, RP_LED1.Data, RP_LED2.Data, RP_LED3.Data, RP_LED4.Data, RP2040_I2C_ALERT, DMX.RX, DMX.EN, DMX.TX, DMX_I2C.SCL, DMX_I2C.SDA, DMX_I2C.ALERT#, DMX_I2C.RESET#, DMX_SPI.CS1, DMX_SPI.SCK, DMX_SPI.MISO, DMX_SPI.MOSI

### Ports
DMX_I2C.ALERT#, DMX_I2C.RESET#, DMX_I2C.SCL, DMX_I2C.SDA, DMX_SPI.CS1, DMX_SPI.MISO, DMX_SPI.MOSI, DMX_SPI.SCK, RESET# (in), RP2040_I2C_ALERT, RP2040_I2C_RESET, RP2040_SCL, RP2040_SDA, RP_LED1.Clock, RP_LED1.Data, RP_LED2.Clock, RP_LED2.Data, RP_LED3.Clock, RP_LED3.Data, RP_LED4.Clock, RP_LED4.Data

### Nets
3V3: C32.2 C33.1 JP23.1 Q3.S R23.2 U14.6(A)
5V_RP2040: F2.1
GND: C28.2 C33.2 U12.2(GND) U14.2(GND)
RP_VSYS: JP23.2 Q3.D U14.4(K)
V_LED: JP22.2 Q2.D U12.4(K)
5V_RP2040_FUSED: C28.1 C29.2 F2.2 JP22.1 Q2.S R21.1 U12.6(A)
DMX.EN: sheet DMX/DMX.EN, sheet PI/DMX.EN
DMX.RX: sheet DMX/DMX.RX, sheet PI/DMX.RX
DMX.TX: sheet DMX/DMX.TX, sheet PI/DMX.TX
DMX_I2C.ALERT#: port DMX_I2C.ALERT#, sheet PI/DMX_I2C.ALERT#
DMX_I2C.RESET#: port DMX_I2C.RESET#, sheet PI/DMX_I2C.RESET#
DMX_I2C.SCL: port DMX_I2C.SCL, sheet PI/DMX_I2C.SCL
DMX_I2C.SDA: port DMX_I2C.SDA, sheet PI/DMX_I2C.SDA
DMX_SPI.CS1: port DMX_SPI.CS1, sheet PI/DMX_SPI.CS1
DMX_SPI.MISO: port DMX_SPI.MISO, sheet PI/DMX_SPI.MISO
DMX_SPI.MOSI: port DMX_SPI.MOSI, sheet PI/DMX_SPI.MOSI
DMX_SPI.SCK: port DMX_SPI.SCK, sheet PI/DMX_SPI.SCK
RP2040_I2C_ALERT: port RP2040_I2C_ALERT, sheet PI/RP2040_I2C_ALERT
RP2040_I2C_RESET: port RP2040_I2C_RESET, sheet PI/RP2040_I2C_RESET
RP2040_RST#: port RESET#, sheet PI/RESET#
RP2040_SCL: port RP2040_SCL, sheet PI/RP2040_SCL
RP2040_SDA: port RP2040_SDA, sheet PI/RP2040_SDA
RP_LED1.Clock: port RP_LED1.Clock, sheet PI/RP_LED1.Clock
RP_LED1.Data: port RP_LED1.Data, sheet PI/RP_LED1.Data
RP_LED2.Clock: port RP_LED2.Clock, sheet PI/RP_LED2.Clock
RP_LED2.Data: port RP_LED2.Data, sheet PI/RP_LED2.Data
RP_LED3.Clock: port RP_LED3.Clock, sheet PI/RP_LED3.Clock
RP_LED3.Data: port RP_LED3.Data, sheet PI/RP_LED3.Data
RP_LED4.Clock: port RP_LED4.Clock, sheet PI/RP_LED4.Clock
RP_LED4.Data: port RP_LED4.Data, sheet PI/RP_LED4.Data
NetC29_1: C29.1 U12.1(VCP)
NetC32_1: C32.1 U14.1(VCP)
NetQ2_G: Q2.G U12.5(G)
NetQ3_G: Q3.G U14.5(G)
NetR21_2: R21.2 U12.3(EN)
NetR23_1: R23.1 U14.3(EN)

### Notes on the sheet
- (near JP22) Only populate jumpers if not supplying power from other input power connectors.
  Only populate jumpers to one USB connector at a time.
- of

### Library data of the parts
C28 C29 C32 C33 = CMP-001-00102-4: Ceramic Capacitor, Multilayer, Ceramic, 100V, 10% +Tol, 10% -Tol, X7R, 15% TC, 0.1uF, Surface Mount, 0603; Max Operating Temperature: 125°C; RoHS Compliant: Yes; Case/Package: 0603; Mounting Technology: Surface Mount; Capacitor Type: Ceramic; Pins: 2; Voltage Rating: 100V; Min Operating Temperature: -55°C; JLCPN: C113803
F2 = CMP-005-00017-1: PTC Resettable Fuse, 6V, 0.055ohm, Surface Mount; Max Operating Temperature: 85°C; Case/Package: 1206; Pins: 2; Min Operating Temperature: -40°C; RoHS Compliant: Yes
JP22 JP23 = CMP-002-00086-5: Connector Type: BOARD CONNECTOR; Pins: 2; Max Operating Temperature: 105°C; RoHS Compliant: Yes; Mounting Technology: Through Hole; Min Operating Temperature: -40°C
Q2 Q3 = CMP-013-00052-1: Single N-Channel 60 V 120 mOhm 12.3 nC 0.8 W Silicon Mosfet - SOT-23; Vgs (Max): 20V; Power: 800mW; Vgs(th) (Max) @ Id: 3; Max Operating Temperature: 150°C; Case/Package: TO-236-3; Mounting Technology: Surface Mount; Min Operating Temperature: -55°C
R21 R23 = CMP-009-00328-2: Fixed Resistor, Metal Glaze/thick Film, 0.1W, 100000ohm, 75V, 0.5% +/-Tol, 100ppm/Cel, Surface Mount, 0603; Power: 100mW; Voltage Rating: 50V; RoHS Compliant: Yes; Max Operating Temperature: 155°C; JLCPN: C163504; Case/Package: 0603; Min Operating Temperature: -55°C; Pins: 2; Mounting Technology: Surface Mount; Tolerance: 0.5%
U12 U14 = CMP-004-00052-1: ORController N-Channel Single Automotive AEC-Q100 6-Pin SOT-26 T/R; Min Operating Temperature: -40°C; Max Operating Temperature: 125°C

## Sheet DMX.SchDoc: DMX / RS485
size B; SheetNumber: 9; SheetTotal: 14
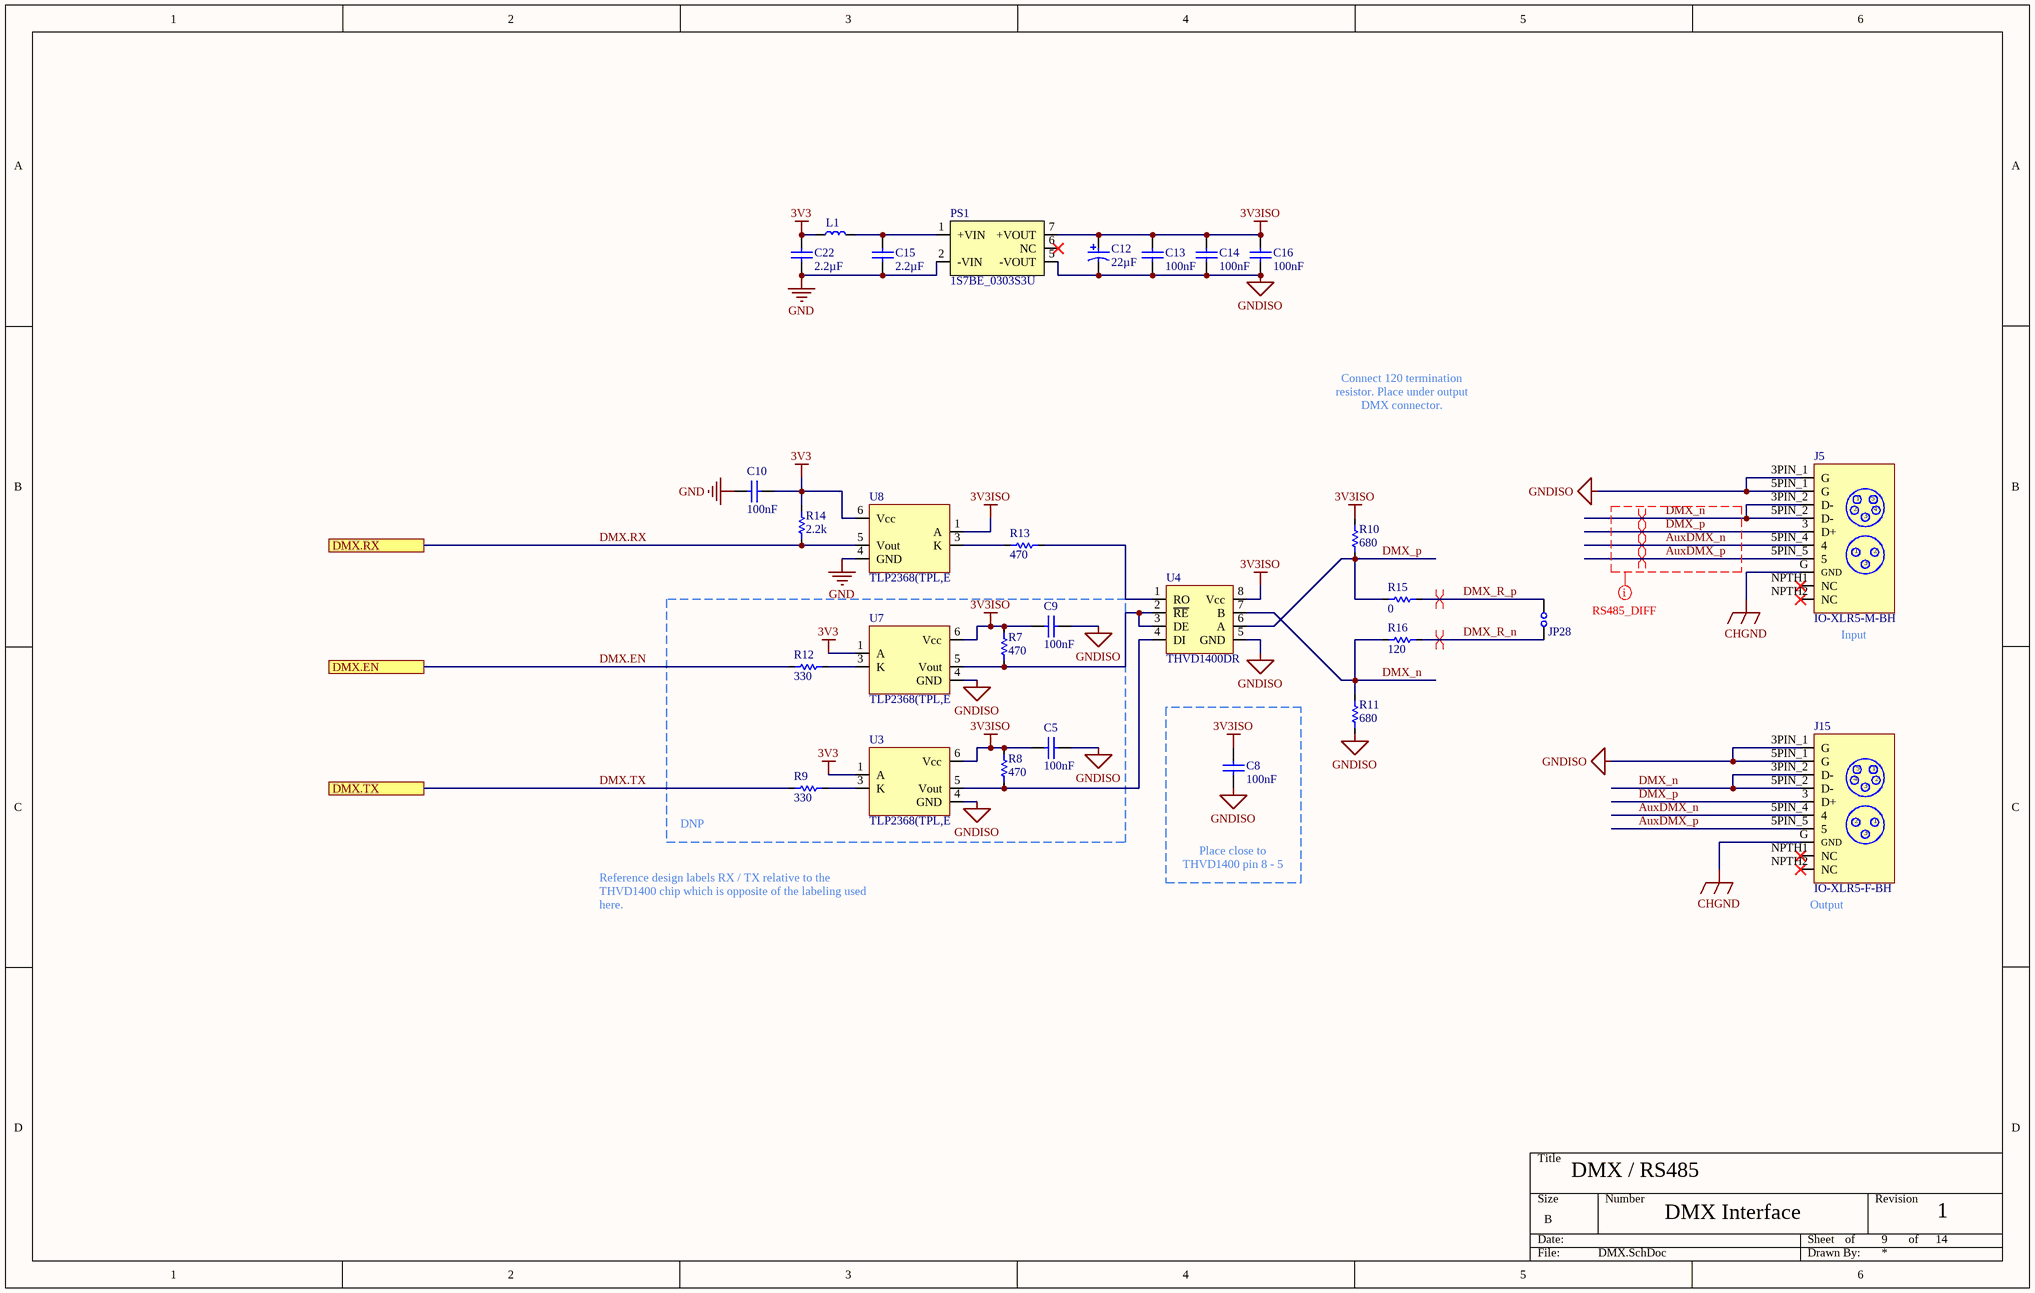
[diagram p2: DMX.SchDoc]

### Parts
C5  value 100nF  [CAPC1608X10N_0603_MED]  (hidden comment: CC0603KRX7R0BB104)
C8  value 100nF  [CAPC1608X10N_0603_MED]  (hidden comment: CC0603KRX7R0BB104)
C9  value 100nF  [CAPC1608X10N_0603_MED]  (hidden comment: CC0603KRX7R0BB104)
C10  value 100nF  [CAPC1608X10N_0603_MED]  (hidden comment: CC0603KRX7R0BB104)
C12  value 22µF  [CAPCP3528X21N_1210_1411_MED]  (hidden comment: TPSB226K010R0500)
C13  value 100nF  [CAPC1608X10N_0603_MED]  (hidden comment: CC0603KRX7R0BB104)
C14  value 100nF  [CAPC1608X10N_0603_MED]  (hidden comment: CC0603KRX7R0BB104)
C15  value 2.2µF  [CAPC2012X14N_0805_MED]  (hidden comment: CGA4J3X7R1H225K125AE)
C16  value 100nF  [CAPC1608X10N_0603_MED]  (hidden comment: CC0603KRX7R0BB104)
C22  value 2.2µF  [CAPC2012X14N_0805_MED]  (hidden comment: CGA4J3X7R1H225K125AE)
J5  IO-XLR5-M-BH  [IO-XLR5-M-BH-Footprint-1]
J15  IO-XLR5-F-BH  [IO-XLR5-F-BH-Footprint-1]
JP28  Jumper 2 x 1 NO 0.1" SMT  [Jumper 2 x 1 NO 0.1" SMT-Footprint-1]  (value not drawn)
L1  SRR6038-180Y  [IND_SRR6038-180Y]  (value not drawn)
PS1  1S7BE_0303S3U  [CONV_1S7BE_0303S3U]
R7  value 470  [RESC1608X06N_0603_MED]  (hidden comment: RC0603FR-07470RL)
R8  value 470  [RESC1608X06N_0603_MED]  (hidden comment: RC0603FR-07470RL)
R9  value 330  [RESC1608X06N_0603_MED]  (hidden comment: RC0603FR-07330RL)
R10  value 680  [RESC1608X06N_0603_MED]  (hidden comment: RC0603FR-07680RL)
R11  value 680  [RESC1608X06N_0603_MED]  (hidden comment: RC0603FR-07680RL)
R12  value 330  [RESC1608X06N_0603_MED]  (hidden comment: RC0603FR-07330RL)
R13  value 470  [RESC1608X06N_0603_MED]  (hidden comment: RC0603FR-07470RL)
R14  value 2.2k  [RESC1608X06N_0603_MED]  (hidden comment: RC0603FR-072K2L)
R15  value 0  [RESC1608X06N_0603_MED]  (hidden comment: RC0603FR-070RL)
R16  value 120  [RESC1608X06N_0603_MED]  (hidden comment: RC0603FR-07120RL)
U3  TLP2368(TPL,E  [SOT125P700X220-5N]
U4  THVD1400DR  [SOIC127P600X175-8N]
U7  TLP2368(TPL,E  [SOT125P700X220-5N]
U8  TLP2368(TPL,E  [SOT125P700X220-5N]

### Ports
DMX.EN, DMX.RX, DMX.TX

### Nets
3V3: C10.1 C22.2 L1.1 R14.2 U3.1(A) U7.1(A) U8.6(Vcc)
3V3ISO: C5.2 C8.1 C9.2 C12.1 C13.2 C14.2 C16.2 PS1.7(+VOUT) R7.2 R8.2 R10.2 U3.6(Vcc) U4.8(Vcc) U7.6(Vcc) U8.1(A)
CHGND: J5.G(GND) J15.G(GND)
GND: C10.2 C15.1 C22.1 PS1.2(-VIN) U8.4(GND)
GNDISO: C5.1 C8.2 C9.1 C12.2 C13.1 C14.1 C16.1 J5.3PIN_1(G) J5.5PIN_1(G) J15.3PIN_1(G) J15.5PIN_1(G) PS1.5(-VOUT) R11.1 U3.4(GND) U4.5(GND) U7.4(GND)
AuxDMX_n: J5.5PIN_4(4) J15.5PIN_4(4)
AuxDMX_p: J5.5PIN_5(5) J15.5PIN_5(5)
DMX.EN: R12.1 ; port DMX.EN
DMX.RX: R14.1 U8.5(Vout) ; port DMX.RX
DMX.TX: R9.1 ; port DMX.TX
DMX_n: J5.3PIN_2(D-) J5.5PIN_2(D-) J15.3PIN_2(D-) J15.5PIN_2(D-) R11.2 R16.1 U4.7(B)
DMX_p: J5.3(D+) J15.3(D+) R10.1 R15.1 U4.6(A)
DMX_R_n: JP28.2 R16.2
DMX_R_p: JP28.1 R15.2
NetC15_2: C15.2 L1.2 PS1.1(+VIN)
NetR7_1: R7.1 U4.2(~{RE}) U4.3(DE) U7.5(Vout)
NetR8_1: R8.1 U3.5(Vout) U4.4(DI)
NetR9_2: R9.2 U3.3(K)
NetR12_2: R12.2 U7.3(K)
NetR13_1: R13.1 U8.3(K)
NetR13_2: R13.2 U4.1(RO)

Not connected (* = marked no-connect by the designer): J5 NPTH1(NC)* NPTH2(NC)*; J15 NPTH1(NC)* NPTH2(NC)*; PS1 6(NC)*

### Layout directives
differential pair; differential pair class 120DP: AuxDMX_n, AuxDMX_p, DMX_n, DMX_p, DMX_R_n, DMX_R_p
rule Impedance Constraint [Min = 110.0    Max = 130.0    ]; net class RS485; rule Matched Net Lengths [Tolerance = 10mil]: AuxDMX_n, AuxDMX_p, DMX_n, DMX_p

### Notes on the sheet
- Connect 120 termination resistor. Place under output DMX connector.
- (near J5) Input
- (near R9) DNP
- Place close to THVD1400 pin 8 - 5
- Reference design labels RX / TX relative to the THVD1400 chip which is opposite of the labeling used here.
- (near J15) Output
- of
- (in symbol CMP-002-00191-7) 1; 2
- (in symbol CMP-002-00192-4) 1; 2

### Library data of the parts
C5 C8-C10 C13 C14 C16 = CMP-001-00102-4: as C28 on sheet DMX_RP2040; Max Operating Temperature: 125°C; RoHS Compliant: Yes; Case/Package: 0603; Mounting Technology: Surface Mount; Capacitor Type: Ceramic; Pins: 2; Voltage Rating: 100V; Min Operating Temperature: -55°C; JLCPN: C113803
C12 = CMP-001-00100-5: Tantalum Capacitor, Polarized, Tantalum (dry/solid), 10V, 10% +Tol, 10% -Tol, 22uF, Surface Mount, 1210; Case/Package: 1411; Pins: 2; Capacitor Type: Tantalum; Voltage Rating: 10V; Max Operating Temperature: 125°C; Mounting Technology: Surface Mount; Tolerance: 10%; RoHS Compliant: Yes; Min Operating Temperature: -55°C; JLCPN: C55530
C15 C22 = CMP-001-00170-2: Ceramic Capacitor, Multilayer, Ceramic, 2.2uF, 50V, 10%, X6S, 0805; Max Operating Temperature: 125°C; Min Operating Temperature: -55°C; Voltage Rating: 50V; Tolerance: 10%; Capacitor Type: Ceramic; RoHS Compliant: Yes; Pins: 2; Mounting Technology: Surface Mount; Case/Package: 0805; JLCPN: C125847
J5 = CMP-002-00191-7: B Series, 5 Pin XLR, Male, Horizontal Pcb Mount With Separate Ground Pin; Gender: Male; Connector Type: XLR; Pins: 5
J15 = CMP-002-00192-4: B-Series 5-Pin XLR Female Horizontal PCB Mount with Separate Ground-Pin Metal Face Plate; Connector Type: XLR; Pins: 5; Gender: Female
JP28 = CMP-00028-00040-2: Connector Type: BOARD CONNECTOR; Pins: 2; Max Operating Temperature: 105°C; RoHS Compliant: Yes; Mounting Technology: SMT; Min Operating Temperature: -40°C
L1 = CMP-006-00028-1: General Purpose Inductor, 18uH, 30%, 1 Element, Ferrite-Core, SMD, 2727; Max Current Rating: 1.7A; Self Resonant Frequency: 13.8MHz; Min Operating Temperature: -40°C; Max Operating Temperature: 125°C; Tolerance: 30%; Pins: 2; RoHS Compliant: Yes
PS1 = CMP-112-000000-3: ISOLATED MODULE DC DC CONVERTERS; MF: Gaptec; Design Item ID: 1S7BE_0303S3U; Source: 1S7BE_0303S3U.SchLib; SnapEDA_Link: https://www.snapeda.com/parts/1S7BE_0303S3U/Gaptec/view-part/?ref=snap; Package: SIP-7 Gaptec; MP: 1S7BE_0303S3U; Check_prices: https://www.snapeda.com/parts/1S7BE_0303S3U/Gaptec/view-part/?ref=eda; Value: *
R7 R8 R13 = CMP-009-00300-2: Fixed Resistor, Metal Glaze/thick Film, 0.1W, 470ohm, 75V, 1% +/-Tol, 100ppm/Cel, Surface Mount, 0603; Power: 100mW; Voltage Rating: 50V; Case/Package: 0603; Tolerance: 1%; Mounting Technology: Surface Mount; Max Operating Temperature: 155°C; Pins: 2; RoHS Compliant: Yes; Min Operating Temperature: -55°C; JLCPN: C114669
R9 R12 = CMP-009-00302-2: Fixed Resistor, Metal Glaze/thick Film, 0.1W, 330ohm, 75V, 1% +/-Tol, 100ppm/Cel, Surface Mount, 0603; Power: 100mW; Voltage Rating: 50V; Min Operating Temperature: -55°C; Pins: 2; RoHS Compliant: Yes; Tolerance: 1%; Mounting Technology: Surface Mount; Max Operating Temperature: 155°C; Case/Package: 0603; JLCPN: C105881
R10 R11 = CMP-009-00301-2: Fixed Resistor, Metal Glaze/thick Film, 0.1W, 680ohm, 75V, 1% +/-Tol, 100ppm/Cel, Surface Mount, 0603; Voltage Rating: 50V; Power: 100mW; Mounting Technology: Surface Mount; Min Operating Temperature: -55°C; Tolerance: 1%; Pins: 2; Case/Package: 0603; Max Operating Temperature: 155°C; RoHS Compliant: Yes; JLCPN: C112310
R14 = CMP-009-00304-2: Fixed Resistor, Metal Glaze/thick Film, 0.1W, 2200ohm, 75V, 1% +/-Tol, 100ppm/Cel, Surface Mount, 0603; Power: 100mW; Voltage Rating: 50V; Min Operating Temperature: -55°C; Max Operating Temperature: 155°C; Tolerance: 1%; Case/Package: 0603; Pins: 2; Mounting Technology: Surface Mount; RoHS Compliant: Yes; JLCPN: C114662
R15 = CMP-009-00204-3: RC Series 0603 0.1 W 0 Ohm Jumper Surface Mount Thick Film Chip Resistor; Power: 100mW; Voltage Rating: 75V; Tolerance: 1%; Mounting Technology: Surface Mount; Pins: 2; Case/Package: 0603; Max Operating Temperature: 155°C; Min Operating Temperature: -55°C; RoHS Compliant: Yes; JLCPN: C100044
R16 = CMP-009-00303-2: Res General Purpose Thick Film 0603 120 Ohm 1% 1/10W ±100ppm/°C Molded SMD Paper T/R; Voltage Rating: 50V; Power: 100mW; Max Operating Temperature: 155°C; Mounting Technology: Surface Mount; Pins: 2; Tolerance: 1%; Min Operating Temperature: -55°C; Case/Package: 0603; RoHS Compliant: Yes; JLCPN: C114640
U3 U7 U8 = CMP-00026-00002-1: Logic IC Output Optocoupler, 1-Channel, 1-Element, 3750V Isolation, 20MBps; Max Operating Temperature: 125°C; Min Operating Temperature: -40°C; RoHS Compliant: Yes; Mounting Technology: Surface Mount
U4 = CMP-015-00028-2: Line Transceiver, 1 Func, 1 Driver, 1 Rcvr, PDSO8; RoHS Compliant: Yes; JLCPN: C3235232